# EAGLE design Pico v2 (EAGLE 4.16)
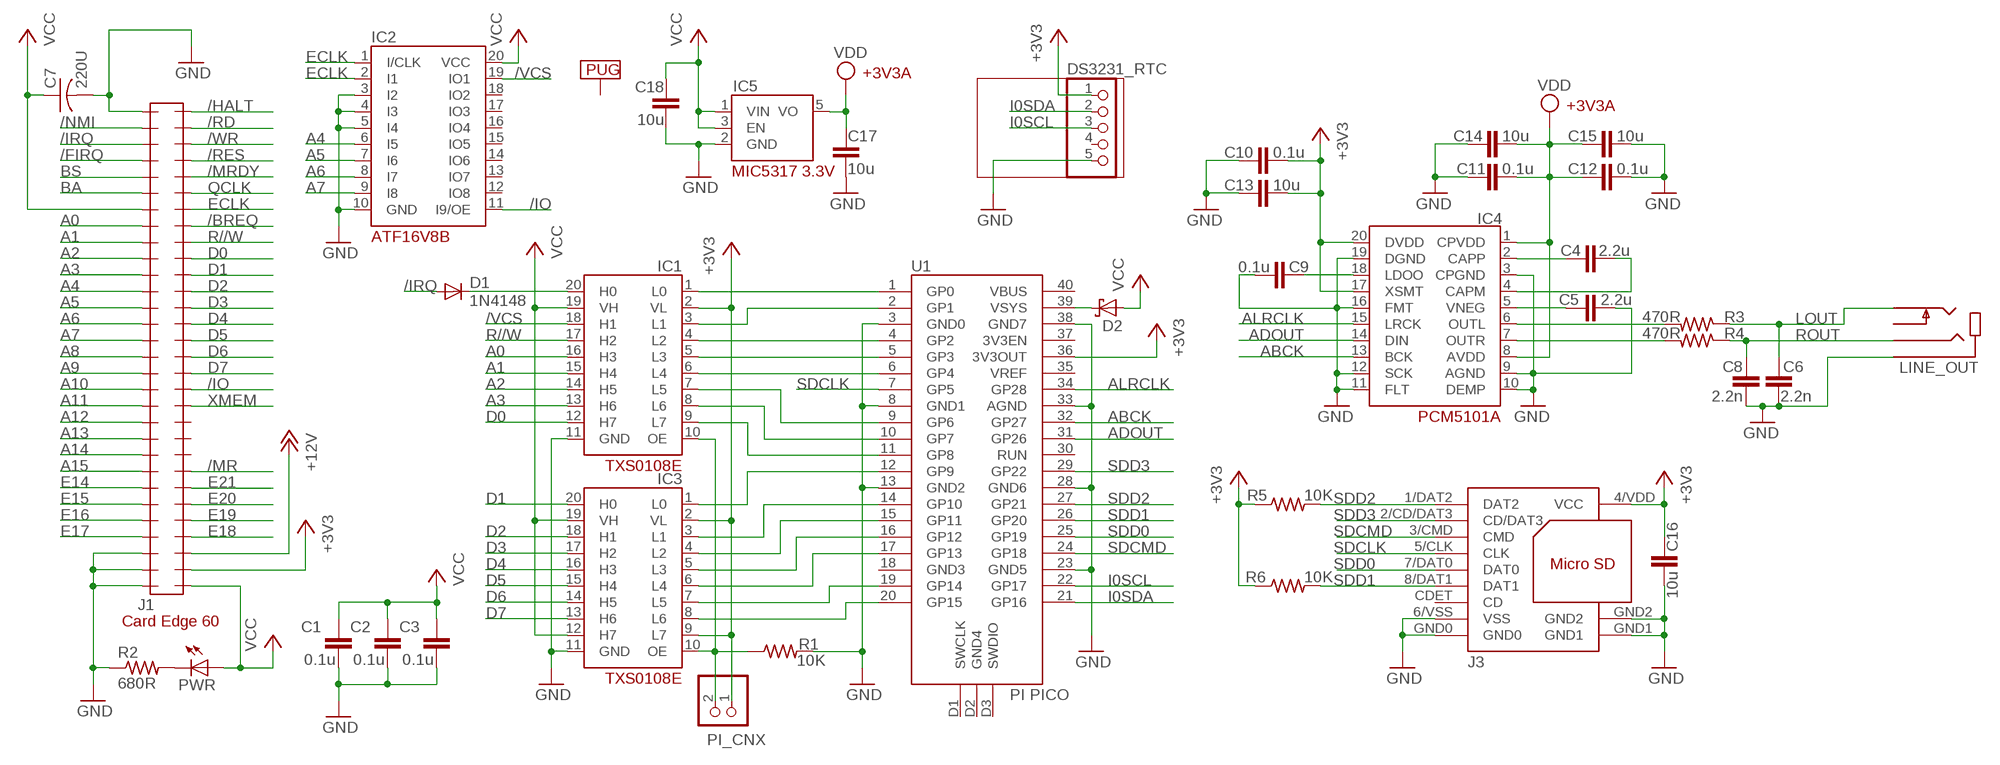
[diagram p0: schematic, sheet 1]

## Parts
C1  0.1u  C-EUC0603  [C0603]
C2  0.1u  C-EUC0603  [C0603]
C3  0.1u  C-EUC0603  [C0603]
C4  2.2u  C-EUC0603  [C0603]
C5  2.2u  C-EUC0603  [C0603]
C6  2.2n  C-EUC0603  [C0603]
C7  220U  C-US025-050X050  [C025-050X050]
C8  2.2n  C-EUC0603  [C0603]
C9  0.1u  C-EUC0603  [C0603]
C10  0.1u  C-EUC0603  [C0603]
C11  0.1u  C-EUC0603  [C0603]
C12  0.1u  C-EUC0603  [C0603]
C13  10u  C-EUC0805  [C0805]
C14  10u  C-EUC0805  [C0805]
C15  10u  C-EUC0805  [C0805]
C16  10u  C-EUC0805  [C0805]
C17  10u  C-EUC0805  [C0805]
C18  10u  C-EUC0805  [C0805]
D1  1N4148  [DO35-10]
D2  SCHOTTKY-DIODEDO35-7  [DO35-7]
DS3231_RTC  PINHD-1X5  [1X05]
IC1  TXS0108E  [TSSOP20]
IC2  PLD_ATF16V8B  [DIL20]
IC3  TXS0108E  [TSSOP20]
IC4  PCM5101A  [TSSOP20]
IC5  MIC5317_3.3V  [SOT23-5]
J1  CARDEDGE_2.54_60POS  CARDEDGE_2.54_60POSEDGE  [CARDEDGE_2.54_60POS]
J3  MICROSD_AMPHENOL_GTFP084328  [MICROSD_AMPHENOL_GTFP08432B1HR]
LINE_OUT  HPHONE_SWITCH_SJ-3524-SMT-TR_  [HPHONE_CUI_SJ-3524-SMT-TR]
PI_CNX  PINHD-1X2  [1X02]
PWR  LED3MM  [LED3MM]
R1  10K  R-US_R0603  [R0603]
R2  680R  R-US_R0603  [R0603]
R3  470R  R-US_R0603  [R0603]
R4  470R  R-US_R0603  [R0603]
R5  10K  R-US_R0603  [R0603]
R6  10K  R-US_R0603  [R0603]
U1  PI_PICO  [PI_PICO]
U$1  PUG  [LARGE_PUG]

## Nets
+3V3 [lowpwr]: C10.1 C13.2 C16.1 DS3231_RTC.1 IC1.2(VL) IC3.2(VL) IC3.9(L7) IC4.17(XSMT) IC4.20(DVDD) J1.32 J3.4/VDD(VCC) PI_CNX.1 R5.1 R6.1 U1.36(3V3OUT)
+12V [supply]: J1.33
/BREQ: J1.53
/FIRQ: J1.4
/HALT: J1.60
/IO: IC2.11(I9/OE) J1.43
/IRQ: D1.A J1.3
/MR: J1.38
/MRDY: J1.56
/NMI: J1.2
/RD: J1.59
/RES: J1.57
/VCS: IC1.18(H1) IC2.19(IO1)
/WR: J1.58
A0: IC1.16(H3) J1.8
A1: IC1.15(H4) J1.9
A2: IC1.14(H5) J1.10
A3: IC1.13(H6) J1.11
A4: IC2.6(I5) J1.12
A5: IC2.7(I6) J1.13
A6: IC2.8(I7) J1.14
A7: IC2.9(I8) J1.15
A8: J1.16
A9: J1.17
A10: J1.18
A11: J1.19
A12: J1.20
A13: J1.21
A14: J1.22
A15: J1.23
ABCK: IC4.13(BCK) U1.32(GP27)
ADOUT: IC4.14(DIN) U1.31(GP26)
ALRCLK: IC4.15(LRCK) U1.34(GP28)
BA: J1.6
BS: J1.5
D0: IC1.12(H7) J1.51
D1: IC3.20(H0) J1.50
D2: IC3.18(H1) J1.49
D3: IC3.17(H2) J1.48
D4: IC3.16(H3) J1.47
D5: IC3.15(H4) J1.46
D6: IC3.14(H5) J1.45
D7: IC3.13(H6) J1.44
E14: J1.24
E15: J1.25
E16: J1.26
E17: J1.27
E18: J1.34
E19: J1.35
E20: J1.36
E21: J1.37
ECLK: IC2.1(I/CLK) IC2.2(I1) J1.54
GND [lowpwr]: C1.2 C2.2 C3.2 C5.2 C6.2 C7.2 C8.2 C9.1 C10.2 C11.2 C12.1 C13.1 C14.1 C15.2 C16.2 C17.2 C18.2 DS3231_RTC.5 IC1.11(GND) IC2.3(I2) IC2.4(I3) IC2.5(I4) IC2.10(GND) IC3.11(GND) IC4.3(CPGND) IC4.9(AGND) IC4.10(DEMP) IC4.11(FLT) IC4.12(SCK) IC4.16(FMT) IC4.19(DGND) IC5.2(GND) J1.1 J1.28 J1.29 J1.30 J3.6/VSS(VSS) J3.GND0 J3.GND1 J3.GND2 LINE_OUT.SLEEVE R1.2 R2.1 U1.3(GND0) U1.8(GND1) U1.13(GND2) U1.23(GND5) U1.28(GND6) U1.33(AGND) U1.38(GND7)
I0SCL: DS3231_RTC.3 U1.22(GP17)
I0SDA: DS3231_RTC.2 U1.21(GP16)
LOUT: C6.1 LINE_OUT.TIP R3.1
N$1: D2.C U1.39(VSYS)
N$2: PWR.K(C) R2.2
N$4: C4.1 IC4.2(CAPP)
N$5: IC1.1(L0) U1.1(GP0)
N$6: IC1.3(L1) U1.2(GP1)
N$7: IC1.4(L2) U1.4(GP2)
N$8: IC1.5(L3) U1.5(GP3)
N$10: IC1.6(L4) U1.6(GP4)
N$11: IC1.7(L5) U1.9(GP6)
N$12: IC1.8(L6) U1.10(GP7)
N$13: IC1.9(L7) U1.11(GP8)
N$14: D1.C IC1.20(H0)
N$15: IC3.1(L0) U1.12(GP9)
N$16: IC3.3(L1) U1.14(GP10)
N$17: IC3.4(L2) U1.15(GP11)
N$18: IC3.5(L3) U1.16(GP12)
N$19: IC3.6(L4) U1.17(GP13)
N$20: IC3.7(L5) U1.19(GP14)
N$21: IC3.8(L6) U1.20(GP15)
N$22: C4.2 IC4.4(CAPM)
N$23: C5.1 IC4.5(VNEG)
N$24: IC1.10(OE) IC3.10(OE) PI_CNX.2 R1.1
N$26: IC4.6(OUTL) R3.2
N$27: IC4.7(OUTR) R4.2
N$30: C9.2 IC4.18(LDOO)
QCLK: J1.55
R//W: IC1.17(H2) J1.52
ROUT: C8.1 LINE_OUT.RING R4.1
SDCLK: J3.5/CLK(CLK) U1.7(GP5)
SDCMD: J3.3/CMD(CMD) U1.24(GP18)
SDD0: J3.7/DAT0(DAT0) U1.25(GP19)
SDD1: J3.8/DAT1(DAT1) R6.2 U1.26(GP20)
SDD2: J3.1/DAT2(DAT2) R5.2 U1.27(GP21)
SDD3: J3.2/CD/DAT3(CD/DAT3) U1.29(GP22)
VCC [lowpwr]: C1.1 C2.1 C3.1 C7.1 C18.1 D2.A IC1.19(VH) IC2.20(VCC) IC3.12(H7) IC3.19(VH) IC5.1(VIN) IC5.3(EN) J1.7 J1.31 PWR.A
VDD [lowpwr]: C11.1 C12.2 C14.2 C15.1 C17.1 IC4.1(CPVDD) IC4.8(AVDD) IC5.5(VO)
XMEM: J1.42
Unconnected: DS3231_RTC.4 IC2.12(IO8) IC2.13(IO7) IC2.14(IO6) IC2.15(IO5) IC2.16(IO4) IC2.17(IO3) IC2.18(IO2) J1.39 J1.40 J1.41 J3.CDET(CD) LINE_OUT.SWITCH(SW) U1.18(GND3) U1.30(RUN) U1.35(VREF) U1.37(3V3EN) U1.40(VBUS) U1.D1(SWCLK) U1.D2(GND4) U1.D3(SWDIO) U$1.P$1

## Notes on the sheet
- +3V3A
- +3V3A

## Library data of the parts
C1-C6 C8-C18 = rcl:C-EU: CAPACITOR, European symbol
C7 = rcl:C-US: CAPACITOR, American symbol
D1 = diode:1N4148: DIODE high speed (Philips)
D2 = diode:SCHOTTKY-DIODE: Schottky Diode
DS3231_RTC = pinhead:PINHD-1X5: PIN HEADER
IC1 IC3 = 07-Retrocomputing:TXS0108E
IC2 = 07-Retrocomputing:PLD_ATF16V8B
IC4 = 01-hacker-daw:PCM5101A
IC5 = 07-Retrocomputing:MIC5317_3.3V
J1 = 07-Retrocomputing:CARDEDGE_2.54_60POS
J3 = 07-Retrocomputing:MICROSD_AMPHENOL_GTFP084328
LINE_OUT = 01-hacker-daw:HPHONE_SWITCH
PI_CNX = pinhead:PINHD-1X2: PIN HEADER
PWR = led:LED: LED OSRAM: - CHIPLED LG R971, LG N971, LY N971, LG Q971, LY Q971, LO R971, LY R971 LH N974, LH R974 LS Q976, LO Q976, LY Q976 LO Q996 - Hyper CHIPLED LW Q18S LB Q993, LB Q99A, LB R99A - SideLED LS A670, LO A670, LY A670, LG A670, LP A670 LB A673, LV A673, LT A673, LW A673 LH A674 LY A675 LS A676, LA A676, LO A676, LY A676, LW A676 LS A679, LY A679, LG A679 - Hyper Micro SIDELED® LS Y876, LA Y876, LO Y876, LY Y876 LT Y87S - SmartLED LW L88C, LW L88S LB L89C, LB L89S, LG L890 LS L89K, LO L89K, LY L89K LS L896, LA L896, LO L896, LY L896 - TOPLED LS T670, LO T670, LY T670, LG T670, LP T670 LSG T670, LSP T670, LSY T670, LOP T670, LYG T670 LG T671, LOG T671, LSG T671 LB T673, LV T673, LT T673, LW T673 LH T674 LS T676, LA T676, LO T676, LY T676, LB T676, LH T676, LSB T676, LW T676 LB T67C, LV T67C, LT T67C, LS T67K, LO T67K, LY T67K, LW E67C LS E67B, LA E67B, LO E67B, LY E67B, LB E67C, LV E67C, LT E67C LW T67C LS T679, LY T679, LG T679 LS T770, LO T770, LY T770, LG T770, LP T770 LB T773, LV T773, LT T773, LW T773 LH T774 LS E675, LA E675, LY E675, LS T675 LS T776, LA T776, LO T776, LY T776, LB T776 LHGB T686 LT T68C, LB T68C - Hyper Mini TOPLED® LB M676 - Mini TOPLED Santana® LG M470 LS M47K, LO M47K, LY M47K Source: http://www.osram.convergy.de - LUMILED® LXK2-PW12-R00, LXK2-PW12-S00, LXK2-PW14-U00, LXK2-PW14-V00 LXK2-PM12-R00, LXK2-PM12-S00, LXK2-PM14-U00 LXK2-PE12-Q00, LXK2-PE12-R00, LXK2-PE12-S00, LXK2-PE14-T00, LXK2-PE14-U00 LXK2-PB12-K00, LXK2-PB12-L00, LXK2-PB12-M00, LXK2-PB14-N00, LXK2-PB14-P00, LXK2-PB14-Q00 LXK2-PR12-L00, LXK2-PR12-M00, LXK2-PR14-Q00, LXK2-PR14-R00 LXK2-PD12-Q00, LXK2-PD12-R00, LXK2-PD12-S00 LXK2-PH12-R00, LXK2-PH12-S00 LXK2-PL12-P00, LXK2-PL12-Q00, LXK2-PL12-R00 Source: www.luxeon.com
R1-R6 = rcl:R-US_: RESISTOR, American symbol
U1 = 07-Retrocomputing:PI_PICO
U$1 = 07-Retrocomputing:PUG

## Net classes
0 default: width 0.203 mm, drill 0.203 mm, clearance 0.254 mm
1 supply: width 0.61 mm, drill 0.203 mm, clearance 0.305 mm
2 lowpwr: width 0.305 mm, drill 0.203 mm, clearance 0.254 mm

## Board
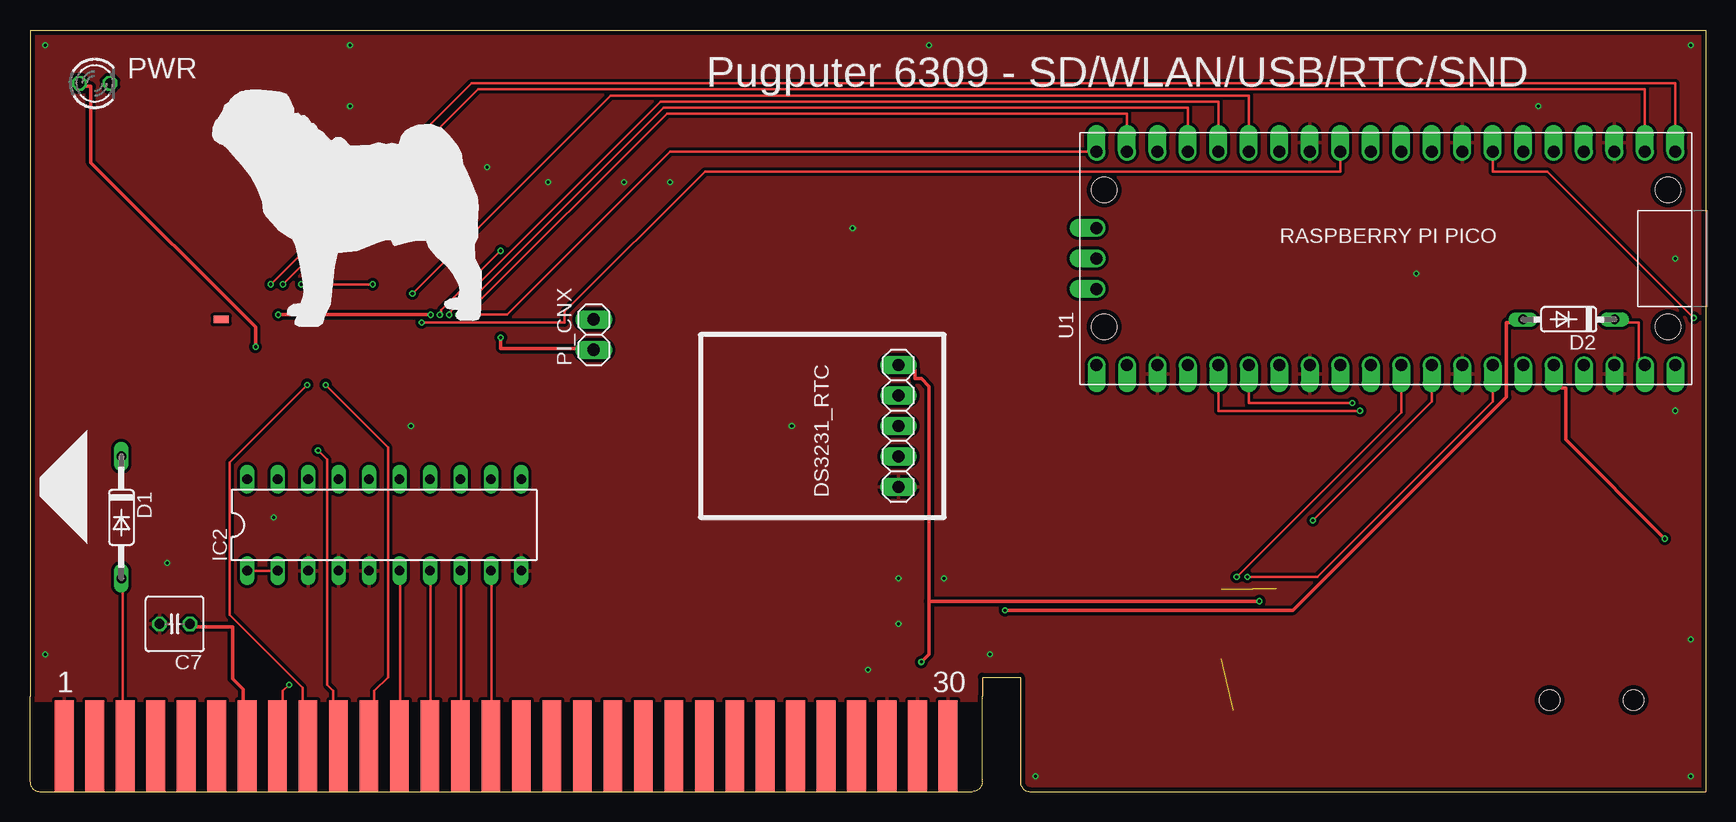
[diagram p1: board, top side]
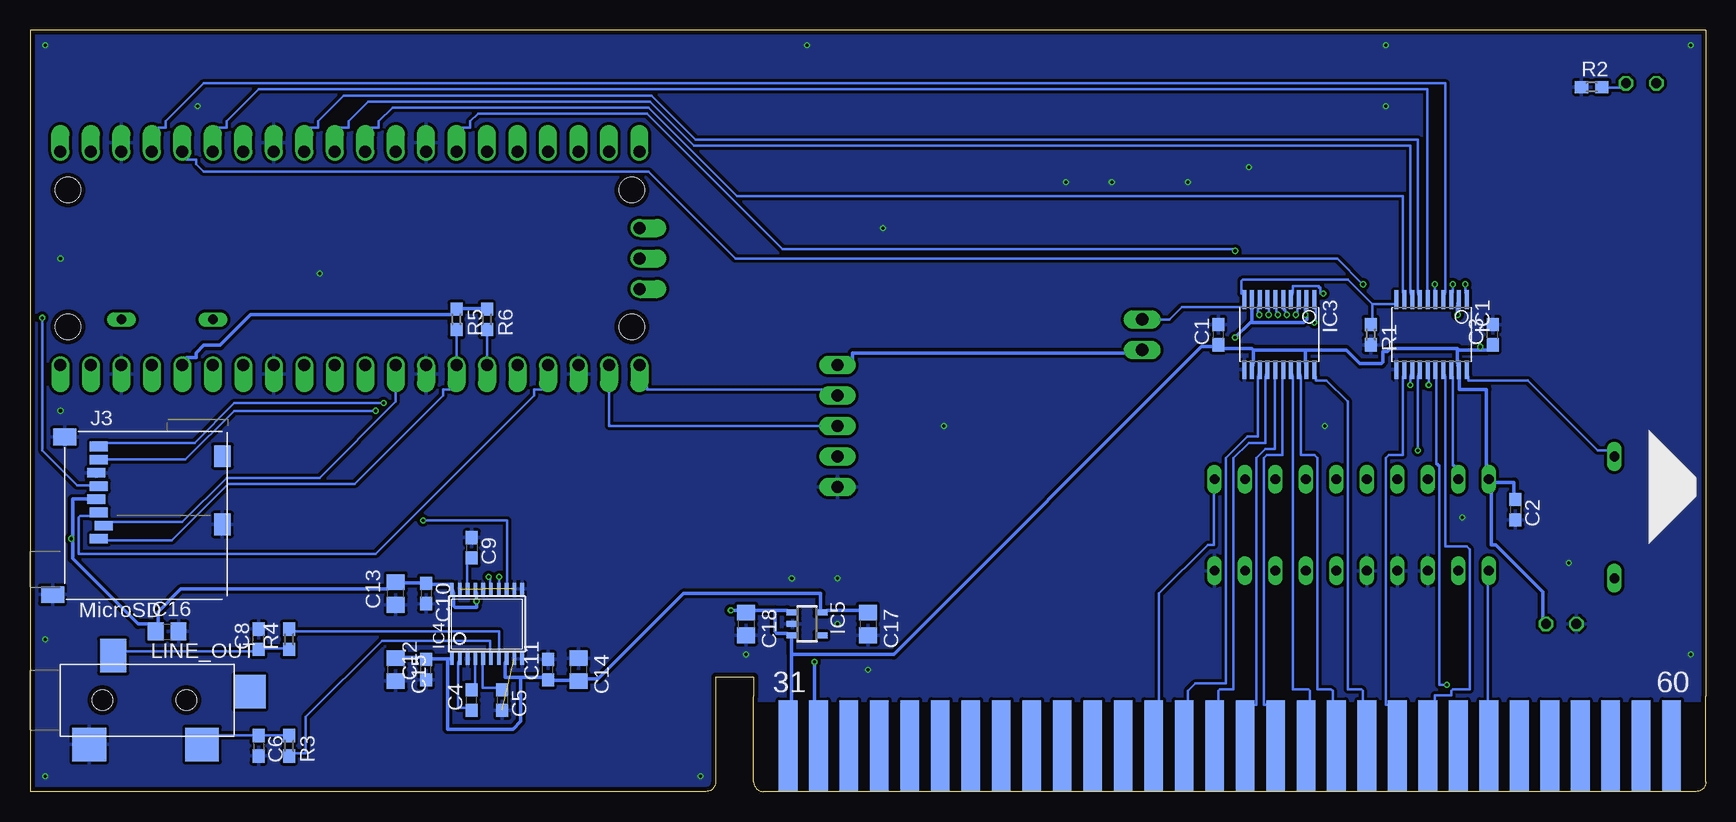
[diagram p2: board, bottom side, seen from below]

Size 139.7 x 63.5 mm. Coordinates in mm from the lower left corner, seen from the top.
Outline: 0,7.94 0,63.5 139.7,63.5 139.7,0 83.34,0 arc-90 82.55,0.79 82.55,9.53 79.38,9.53 79.38,7.94
Copper layers (1*16): Top 0.0356mm / dielectric 1.6mm / Bottom 0.0356mm
Design rules "oshpark-2layer": minimum track width 6mil, minimum drill 10mil, track to track 6mil, track to pad 6mil, pad to pad 6mil, via to via 6mil, smd to smd 6mil, copper to edge 15mil, drill to drill 6mil, minimum pad ring 5mil, minimum via ring 5mil, stop-mask expansion 2.5mil, vias tented up to drill 0mil, thermal gap 10mil
vRestrict: area 122.2,21.4 to 139.7,38.1

### Footprints (pad centres in the part's own frame; a part is rotated, then mirrored left to right if it is on the bottom)
C0603 = smd 1.1 x 1: 1 -0.85,0; 2 0.85,0
C025-050X050 = drill 0.813 octagon: 1 -1.27,0; 2 1.27,0
C0805 = smd 1.3 x 1.5: 1 -0.95,0; 2 0.95,0
DO35-10 = drill 0.813 long: A 5.08,0; C -5.08,0
DO35-7 = drill 0.813 long: A 3.81,0; C -3.81,0
1X05 = drill 1.016 long: 1 -5.08,0; 2 -2.54,0; 3 0,0; 4 2.54,0; 5 5.08,0
TSSOP20 = smd 1.5 x 0.35: 1 -2.925,2.925; 2 -2.925,2.275; 3 -2.925,1.625; 4 -2.925,0.975; 5 -2.925,0.325; 6 -2.925,-0.325; 7 -2.925,-0.975; 8 -2.925,-1.625; 9 -2.925,-2.275; 10 -2.925,-2.925; 11 2.925,-2.925; 12 2.925,-2.275; 13 2.925,-1.625; 14 2.925,-0.975; 15 2.925,-0.325; 16 2.925,0.325; 17 2.925,0.975; 18 2.925,1.625; 19 2.925,2.275; 20 2.925,2.925
DIL20 = drill 0.813 long: 1 -11.43,-3.81; 2 -8.89,-3.81; 3 -6.35,-3.81; 4 -3.81,-3.81; 5 -1.27,-3.81; 6 1.27,-3.81; 7 3.81,-3.81; 8 6.35,-3.81; 9 8.89,-3.81; 10 11.43,-3.81; 11 11.43,3.81; 12 8.89,3.81; 13 6.35,3.81; 14 3.81,3.81; 15 1.27,3.81; 16 -1.27,3.81; 17 -3.81,3.81; 18 -6.35,3.81; 19 -8.89,3.81; 20 -11.43,3.81
TSSOP20' = smd 0.305 x 0.991: 1 -2.925,-2.918; 2 -2.275,-2.918; 3 -1.625,-2.918; 4 -0.975,-2.918; 5 -0.325,-2.918; 6 0.325,-2.918; 7 0.975,-2.918; 8 1.625,-2.918; 9 2.275,-2.918; 10 2.925,-2.918; 11 2.925,2.918; 12 2.275,2.918; 13 1.625,2.918; 14 0.975,2.918; 15 0.325,2.918; 16 -0.325,2.918; 17 -0.975,2.918; 18 -1.625,2.918; 19 -2.275,2.918; 20 -2.925,2.918
SOT23-5 = smd 0.5 x 1: 1 -0.95,-1.2; 2 0,-1.2; 3 0.95,-1.2; 4 0.95,1.2; 5 -0.95,1.2
CARDEDGE_2.54_60POS = smd 1.556 x 7.62: 1 -36.83,3.81; 2 -34.29,3.81; 3 -31.75,3.81; 4 -29.21,3.81; 5 -26.67,3.81; 6 -24.13,3.81; 7 -21.59,3.81; 8 -19.05,3.81; 9 -16.51,3.81; 10 -13.97,3.81; 11 -11.43,3.81; 12 -8.89,3.81; 13 -6.35,3.81; 14 -3.81,3.81; 15 -1.27,3.81; 16 1.27,3.81; 17 3.81,3.81; 18 6.35,3.81; 19 8.89,3.81; 20 11.43,3.81; 21 13.97,3.81; 22 16.51,3.81; 23 19.05,3.81; 24 21.59,3.81; 25 24.13,3.81; 26 26.67,3.81; 27 29.21,3.81; 28 31.75,3.81; 29 34.29,3.81; 30 36.83,3.81 | smd 1.556 x 7.62 bottom: 31 36.83,3.81; 32 34.29,3.81; 33 31.75,3.81; 34 29.21,3.81; 35 26.67,3.81; 36 24.13,3.81; 37 21.59,3.81; 38 19.05,3.81; 39 16.51,3.81; 40 13.97,3.81; 41 11.43,3.81; 42 8.89,3.81; 43 6.35,3.81; 44 3.81,3.81; 45 1.27,3.81; 46 -1.27,3.81; 47 -3.81,3.81; 48 -6.35,3.81; 49 -8.89,3.81; 50 -11.43,3.81; 51 -13.97,3.81; 52 -16.51,3.81; 53 -19.05,3.81; 54 -21.59,3.81; 55 -24.13,3.81; 56 -26.67,3.81; 57 -29.21,3.81; 58 -31.75,3.81; 59 -34.29,3.81; 60 -36.83,3.81
MICROSD_AMPHENOL_GTFP08432B1HR = smd 0.8 x 1.5: 1/DAT2 1.95,-10.3; 2/CD/DAT3 0.85,-9.9; 3/CMD -0.25,-10.3; 4/VDD -1.35,-10.5; 5/CLK -2.45,-10.3; 6/VSS -3.55,-10.5; 7/DAT0 -4.65,-10.3; 8/DAT1 -5.75,-10.3 | smd 1.8 x 1.4: CDET -4.95,0; GND0 0.75,0 | smd 1.4 x 1.9: GND1 -6.55,-13.15; GND2 6.6,-14.15
HPHONE_CUI_SJ-3524-SMT-TR = smd 2.2 x 2.8: RING 4.4,3.7 | smd 2.8 x 2.8: SLEEVE 2.4,-3.7; TIP 11.8,-3.7 | smd 2.6 x 2.8: SWITCH 15.8,0.7 | hole 1.7: 3.5,0; 10.5,0
1X02 = drill 1.016 long: 1 -1.27,0; 2 1.27,0
LED3MM = drill 0.813 octagon: A -1.27,0; K 1.27,0
R0603 = smd 1.1 x 1: 1 -0.85,0; 2 0.85,0
PI_PICO = drill 1 offset: 1 -8.89,24.13; 2 -8.89,21.59; 3 -8.89,19.05; 4 -8.89,16.51; 5 -8.89,13.97; 6 -8.89,11.43; 7 -8.89,8.89; 8 -8.89,6.35; 9 -8.89,3.81; 10 -8.89,1.27; 11 -8.89,-1.27; 12 -8.89,-3.81; 13 -8.89,-6.35; 14 -8.89,-8.89; 15 -8.89,-11.43; 16 -8.89,-13.97; 17 -8.89,-16.51; 18 -8.89,-19.05; 19 -8.89,-21.59; 20 -8.89,-24.13; 21 8.89,-24.13; 22 8.89,-21.59; 23 8.89,-19.05; 24 8.89,-16.51; 25 8.89,-13.97; 26 8.89,-11.43; 27 8.89,-8.89; 28 8.89,-6.35; 29 8.89,-3.81; 30 8.89,-1.27; 31 8.89,1.27; 32 8.89,3.81; 33 8.89,6.35; 34 8.89,8.89; 35 8.89,11.43; 36 8.89,13.97; 37 8.89,16.51; 38 8.89,19.05; 39 8.89,21.59; 40 8.89,24.13; D1 -2.54,-24.13; D2 0,-24.13; D3 2.54,-24.13 | hole 2.1: -5.7,23.5; 5.7,23.5; 5.7,-23.5; -5.7,-23.5
LARGE_PUG = smd 1.27 x 0.635: P$1 2.286,3.962

### Placement (x,y rotation side)
C1  40.64,38.1 90 bottom
C2  15.88,23.5 270 bottom
C3  17.78,38.1 90 bottom
C4  102.87,7.62 90 bottom
C5  100.33,7.62 270 bottom
C6  120.65,3.81 270 bottom
C7  12.06,13.97 180 top
C8  120.65,12.7 90 bottom
C9  102.87,20.32 270 bottom
C10  106.68,16.51 270 bottom
C11  96.52,10.16 90 bottom
C12  106.68,10.16 90 bottom
C13  109.22,16.51 90 bottom
C14  93.98,10.16 270 bottom
C15  109.22,10.16 270 bottom
C16  128.27,13.34 0 bottom
C17  69.85,13.97 270 bottom
C18  80.01,13.97 270 bottom
D1  7.62,22.86 270 top
D2  128.27,39.37 180 top
DS3231_RTC  72.39,30.48 270 top
IC1  22.86,38.1 270 bottom
IC2  29.53,22.23 0 top
IC3  35.56,38.1 270 bottom
IC4  PCM5101A  [TSSOP20']  101.6,13.97 0 bottom
IC5  74.93,13.97 270 bottom
J1  39.69,0 0 top
J3  123.67,23.02 270 bottom
LINE_OUT  137.16,7.62 0 bottom
PI_CNX  46.99,38.1 90 top
PWR  5.4,59.05 0 top
R1  27.94,38.1 270 bottom
R2  9.53,58.74 0 bottom
R3  118.11,3.81 270 bottom
R4  118.11,12.7 90 bottom
R5  104.14,39.37 270 bottom
R6  101.6,39.37 270 bottom
U1  113.03,44.45 270 top
U$1  13.65,35.4 0 top

### Tracks (layer width: path | path; a pad name or v marks a point on that pad's centre or on a via)
+3V3  (via drill 0.25)
  Top 0.305: v136.27,21.08 128.02,29.34 128.02,33.66 127.64,33.66 U1.36 | v20.7,39.75 v33.4,39.75 | v39.24,37.85 39.24,36.96 45.59,36.96 PI_CNX.1 | v74.3,10.79 74.93,11.43 74.93,15.88 | 74.93,15.88 74.93,33.78 74.3,34.42 73.79,34.42 73.79,35.18 DS3231_RTC.1 | 74.93,15.88 v102.49,15.88
  Bottom 0.305: R6.1 101.98,40.26 103.76,40.26 R5.1 104.52,39.75 121.28,39.75 123.83,37.21 125.22,37.21 125.86,36.58 125.86,36.2 126.62,36.2 U1.36 | IC4.17 102.49,16.51 v102.49,15.88 102.49,15.37 104.27,15.37 104.39,15.49 104.39,16.51 IC4.20 104.65,17.27 106.3,17.27 C10.1 107.06,17.4 108.58,17.4 C13.2 109.86,16.89 127.13,16.89 129.03,14.99 129.03,13.97 C16.1 129.79,13.97 130.68,13.97 136.14,19.43 136.14,21.08 | 136.14,21.08 136.14,24.38 134.87,24.38 J3.4/VDD | 136.14,21.08 v136.27,21.08 | v20.7,39.75 20.7,40.39 IC1.2 | IC3.2 33.4,40.39 v33.4,39.75 33.27,39.62 33.27,39.37 33.53,39.12 37.85,39.12 | 37.85,39.12 37.85,40.39 IC3.9 | v39.24,37.85 37.97,39.12 37.85,39.12 | DS3231_RTC.1 71.12,36.07 71.12,36.58 48.39,36.58 PI_CNX.1 | v74.3,10.79 74.3,7.49 J1.32
/IO
  Bottom 0.203: IC2.11 41.02,24.89 41.02,20.57 41.53,20.57 45.59,16.51 45.59,7.49 J1.43
/IRQ
  Top 0.203: D1.A 7.75,16.64 7.75,7.49 J1.3
/VCS
  Bottom 0.203: IC1.18 21.08,34.54 21.08,27.18 20.95,27.18 IC2.19
A0  (via drill 0.25)
  Top 0.203: v21.59,8.89 21.08,8.38 21.08,7.49 J1.8
  Bottom 0.203: v21.59,8.89 22.23,8.89 22.23,27.18 22.35,27.18 22.35,27.3 22.48,27.3 22.48,34.54 IC1.16
A1  (via drill 0.25)
  Top 0.203: v23.11,33.91 16.64,27.43 16.64,14.73 22.73,8.64 22.73,7.49 J1.9
  Bottom 0.203: v23.11,33.91 23.11,34.54 IC1.15
A2  (via drill 0.25)
  Top 0.203: v24,28.45 24.77,27.69 24.77,8.89 25.27,8.38 25.27,7.49 J1.10
  Bottom 0.203: v24,28.45 24,34.54 IC1.14
A3  (via drill 0.25)
  Top 0.203: v24.64,33.91 29.84,28.7 29.84,9.53 28.7,8.38 28.7,7.49 J1.11
  Bottom 0.203: v24.64,33.91 24.64,34.54 IC1.13
A4
  Top 0.203: IC2.6 30.86,17.27 30.86,7.49 J1.12
A5
  Top 0.203: IC2.7 33.4,17.27 33.4,7.49 J1.13
A6
  Top 0.203: IC2.8 35.94,17.27 35.94,7.49 J1.14
A7
  Top 0.203: IC2.9 38.48,17.27 38.48,7.49 J1.15
ABCK  (via drill 0.25)
  Top 0.203: v106.93,22.61 116.84,32.51 U1.32
  Bottom 0.203: v106.93,22.61 99.95,22.61 99.95,17.27 IC4.13
ADOUT  (via drill 0.25)
  Top 0.203: v100.58,17.91 114.3,31.62 U1.31
  Bottom 0.203: v100.58,17.91 100.58,17.27 IC4.14
ALRCLK  (via drill 0.25)
  Top 0.203: v101.47,17.91 107.31,17.91 121.92,32.51 U1.34
  Bottom 0.203: v101.47,17.91 101.35,17.91 101.35,17.27 IC4.15
D0
  Bottom 0.203: IC1.12 25.27,34.54 25.27,28.07 26.42,28.07 26.67,27.81 26.67,7.24 26.42,7.24 J1.51
D1
  Bottom 0.203: IC3.20 32.51,34.54 32.51,34.29 31.62,34.29 29.84,32.51 29.84,8.51 28.7,8.51 28.57,8.38 28.57,7.49 J1.50
D2
  Bottom 0.203: IC3.18 33.78,34.54 33.78,28.07 32.64,28.07 32.38,27.81 32.38,8.51 31.24,8.51 31.11,8.38 31.11,7.49 J1.49
D3
  Bottom 0.203: IC3.17 34.42,34.54 34.42,8.51 33.15,8.51 33.02,8.38 33.02,7.49 J1.48
D4
  Bottom 0.203: IC3.16 35.31,34.54 35.31,28.07 36.58,28.07 36.83,27.81 36.83,7.24 36.58,7.24 J1.47
D5
  Bottom 0.203: IC3.15 35.94,34.54 35.94,28.57 36.7,28.57 37.47,27.81 37.47,7.24 37.72,7.24 J1.46
D6
  Bottom 0.203: IC3.14 36.7,34.54 36.7,29.08 38.1,29.08 39.37,27.81 39.37,8.51 40.51,8.51 40.64,8.38 40.64,7.49 J1.45
D7
  Bottom 0.203: IC3.13 37.34,34.54 37.34,29.59 38.23,29.59 40.01,27.81 40.01,9.02 42.55,9.02 43.18,8.38 43.18,7.49 J1.44
ECLK
  Top 0.203: IC2.1 IC2.2
  Bottom 0.203: IC2.1 18.16,17.27 18.16,7.49 J1.54
GND  (via drill 0.25)  (3 unrouted)
  other vias: 1.27,62.23 1.27,11.43 80.01,11.43 83.82,1.27 69.85,10.16 72.39,13.97 72.39,17.78 76.2,17.78 138.43,1.27 138.43,12.7 137.16,31.75 137.16,44.45 138.43,62.23 115.57,43.18 63.5,30.48 20.32,22.86 31.75,30.48 74.93,62.23 68.58,46.99 53.34,50.8 49.53,50.8 43.18,50.8 38.1,52.07 26.67,57.15 11.43,19.05 26.67,62.23 125.73,57.15
  pour Bottom: 0,63.5 139.7,63.5 139.7,0 82.55,0 82.55,7.62 0,7.62
  pour Top: 0,63.5 139.7,63.5 139.7,0 82.55,0 82.55,7.62 0,7.62
I0SCL
  Bottom 0.203: U1.22 91.44,30.48 DS3231_RTC.3
I0SDA
  Bottom 0.203: U1.21 88.27,33.66 88.27,33.53 73.66,33.53 DS3231_RTC.2
LOUT
  Bottom 0.203: R3.1 118.49,4.7 120.27,4.7 C6.1 121.03,4.7 124.08,4.7 LINE_OUT.TIP
N$1
  Top 0.203: D2.C 133.22,39.12 134.11,39.12 134.11,36.07 U1.39
N$2
  Bottom 0.203: R2.2 8.13,58.67 7.11,58.67 PWR.K
N$4
  Bottom 0.203: IC4.2 104.01,10.67 104.01,6.99 103.25,6.99 C4.1
N$5  (via drill 0.25)
  Top 0.203: v20.07,42.29 36.83,59.05 137.16,59.05 U1.1
  Bottom 0.203: v20.07,42.29 20.07,41.66 IC1.1
N$6  (via drill 0.25)
  Top 0.203: v21.08,42.29 37.34,58.55 134.62,58.55 U1.2
  Bottom 0.203: v21.08,42.29 21.08,41.66 IC1.3
N$7
  Bottom 0.203: IC1.4 21.72,41.66 21.72,59.05 125.22,59.05 128.4,55.88 128.4,55.37 129.03,55.37 U1.4
N$8  (via drill 0.25)
  Top 0.203: v22.61,42.29 v28.57,42.29
  Bottom 0.203: v22.61,42.29 22.61,41.66 IC1.5 | v28.57,42.29 30.73,44.45 80.9,44.45 88.14,51.69 125.22,51.69 125.86,52.32 125.86,52.7 126.62,52.7 U1.5
N$10
  Bottom 0.203: IC1.6 23.24,41.66 23.24,58.55 120.65,58.55 123.32,55.88 123.32,55.37 123.95,55.37 U1.6
N$11
  Bottom 0.203: IC1.7 24,41.66 24,54.36 84.2,54.36 87.88,58.04 113.54,58.04 115.7,55.88 115.7,55.37 116.33,55.37 U1.9
N$12
  Bottom 0.203: IC1.8 24.64,41.66 24.64,53.85 84.33,53.85 88.01,57.53 111.51,57.53 113.16,55.88 113.16,55.37 113.79,55.37 U1.10
N$13
  Bottom 0.203: IC1.9 25.27,41.66 25.27,49.66 80.77,49.66 88.14,57.02 109.47,57.02 110.62,55.88 110.62,55.37 111.25,55.37 U1.11
N$14
  Bottom 0.203: IC1.20 19.81,34.54 19.81,34.29 14.86,34.29 9.02,28.45 8.13,28.45 D1.C
N$15  (via drill 0.25)
  Top 0.203: v32.64,39.12 44.58,39.12 44.58,40.01 56.26,51.69 109.22,51.69 U1.12
  Bottom 0.203: v32.64,39.12 32.51,39.12 32.51,40.39 IC3.1
N$16  (via drill 0.25)
  Top 0.203: v34.16,39.75 34.29,39.88 34.29,40.13 v39.24,45.09
  Bottom 0.203: v34.16,39.75 34.04,39.75 34.04,40.39 IC3.3 | v39.24,45.09 39.37,45.21 76.96,45.21 88.27,56.52 102.36,56.52 103,55.88 103,55.37 103.63,55.37 U1.14
N$17  (via drill 0.25)
  Top 0.203: v31.88,41.53 48.39,58.04 101.6,58.04 U1.15
  Bottom 0.203: v31.88,41.53 32.13,41.53 32.13,42.04 32.26,42.04 32.26,42.16 34.42,42.16 34.42,41.66 IC3.4
N$18  (via drill 0.25)
  Top 0.203: v34.92,39.75 35.05,39.88 35.05,40.01 52.58,57.53 99.06,57.53 U1.16
  Bottom 0.203: v34.92,39.75 35.05,39.75 35.05,40.13 35.18,40.13 35.18,40.39 IC3.5
N$19  (via drill 0.25)
  Top 0.203: v35.69,39.75 35.81,39.88 35.81,40.01 52.83,57.02 96.52,57.02 U1.17
  Bottom 0.203: v35.69,39.75 35.81,39.75 35.81,40.39 IC3.6
N$20  (via drill 0.25)
  Top 0.203: v36.45,39.75 36.58,39.88 36.58,40.01 53.09,56.52 91.44,56.52 U1.19
  Bottom 0.203: v36.45,39.75 36.45,40.39 IC3.7
N$21  (via drill 0.25)
  Top 0.203: v37.21,39.75 39.75,39.75 53.34,53.34 U1.20
  Bottom 0.203: v37.21,39.75 37.34,39.75 37.34,40.39 IC3.8
N$22
  Bottom 0.203: IC4.4 102.62,10.67 102.62,9.02 C4.2
N$23
  Bottom 0.203: IC4.5 101.98,10.67 101.98,8.64 100.71,8.64 C5.1
N$24
  Bottom 0.203: 27.81,40.64 27.81,39.5 R1.1 | 27.81,40.64 25.91,40.64 IC1.10 | PI_CNX.2 44.7,39.37 43.69,40.39 38.61,40.39 IC3.10 38.61,41.53 38.73,41.53 38.73,42.55 38.61,42.67 29.84,42.67 27.81,40.64
N$26
  Bottom 0.203: IC4.6 101.35,11.43 101.35,12.57 110.36,12.57 116.71,6.22 116.71,3.17 117.73,3.17 R3.2
N$27
  Bottom 0.203: IC4.7 100.58,11.43 100.58,13.34 117.73,13.34 R4.2
N$30
  Bottom 0.203: IC4.18 103.25,17.27 103.25,18.92 C9.2
R//W
  Bottom 0.203: IC1.17 21.72,34.54 21.72,20.45 19.94,20.45 19.68,20.19 19.68,8.51 21.08,8.51 21.21,8.38 21.21,8 22.61,8 22.61,7.49 J1.52
ROUT
  Bottom 0.203: R4.1 118.49,11.94 120.27,11.94 C8.1 121.03,11.68 131.7,11.68 LINE_OUT.RING
SDCLK  (via drill 0.25)
  Top 0.203: v138.68,39.5 126.49,51.69 121.92,51.69 U1.7
  Bottom 0.203: v138.68,39.5 138.68,28.45 135.76,25.53 134.62,25.53 J3.5/CLK
SDCMD
  Bottom 0.203: J3.3/CMD 134.62,22.99 135.51,22.99 135.64,22.86 135.64,19.81 110.87,19.81 97.66,33.02 97.66,33.53 97.03,33.53 U1.24
SDD0  (via drill 0.25)
  Top 0.203: v110.87,31.75 99.06,31.75 U1.25
  Bottom 0.203: v110.87,31.75 122.68,31.75 126.75,27.69 133.22,27.69 J3.7/DAT0
SDD1  (via drill 0.25)
  Top 0.203: v110.24,32.38 101.6,32.38 U1.26
  Bottom 0.203: U1.26 R6.2 | v110.24,32.38 122.68,32.38 125.98,29.08 133.22,29.08 J3.8/DAT1
SDD2
  Bottom 0.203: R5.2 U1.27 104.65,33.53 105.28,33.53 105.28,33.02 112.65,25.65 123.19,25.65 127.89,20.95 133.22,20.95 J3.1/DAT2
SDD3
  Bottom 0.203: J3.2/CD/DAT3 132.84,22.48 127,22.48 123.32,26.16 115.57,26.16 109.22,32.51 U1.29
VCC  (via drill 0.25)
  Top 0.305: v81.28,15.11 105.28,15.11 123.06,32.89 123.06,39.12 123.32,39.12 D2.A | C7.1 13.84,13.72 16.89,13.72 16.89,9.4 17.78,8.51 17.78,7.49 J1.7 | v18.8,37.08 18.8,38.73 5.08,52.45 5.08,58.8 4.7,58.8 PWR.A
  Bottom 0.305: 76.2,11.43 76.2,7.49 J1.31 | 76.2,11.43 76.2,12.83 IC5.3 76.58,13.21 77.47,13.21 77.6,13.34 77.6,15.11 | 77.6,15.11 79.38,15.11 C18.1 80.64,15.11 v81.28,15.11 | 77.6,15.11 76.58,15.11 IC5.1 | C2.1 16,24.89 16,25.78 17.53,25.78 IC2.20 | IC2.20 17.91,24.89 17.91,20.57 17.53,20.57 13.59,16.64 13.59,14.48 C7.1 | 37.72,36.83 37.85,36.96 40.26,36.96 C1.1 41.02,37.08 42.04,37.08 67.69,11.43 76.2,11.43 | 37.72,36.83 37.72,35.81 IC3.12 | 33.4,36.83 33.4,35.81 IC3.19 | 33.4,36.83 37.72,36.83 | 20.7,36.83 18.8,36.83 | 18.8,36.83 18.16,36.83 C3.1 | 20.7,36.83 20.7,35.81 IC1.19 20.57,34.54 20.57,33.53 18.29,33.53 18.29,27.18 IC2.20 | 18.8,36.83 v18.8,37.08 | 33.4,36.83 29.97,36.83 28.83,35.69 27.05,35.69 26.92,35.81 26.92,36.7 26.54,36.7 26.29,36.96 20.7,36.96 20.7,36.83
VDD
  Bottom 0.305: 104.9,11.05 106.3,11.05 C12.2 107.06,11.18 108.58,11.18 C15.1 | 104.9,11.05 104.65,11.05 IC4.1 | C17.1 70.48,15.11 73.28,15.11 IC5.5 73.79,15.11 73.79,16.51 85.22,16.51 92.33,9.4 93.34,9.4 C14.2 94.61,9.27 96.14,9.27 C11.1 96.9,9.53 98.81,9.53 | 98.81,9.53 100.08,9.53 100.08,10.67 IC4.8 | 104.9,11.05 104.9,5.21 99.44,5.21 98.81,5.84 98.81,9.53

### Text on the board
tPlace: Pugputer 6309 - SD/WLAN/USB/RTC/SND